# Altium project tester_board.PrjPCB (part 3 of 4)

## Sheet pulse_gen.SchDoc: Pulse Generation
size A; Engineer: A. Peck; Organization: UCLA High Energy Physics; DocumentNumber: 11; Revision: 3.0; SheetNumber: 11; SheetTotal: 15; Project: LCT Comparator Tester
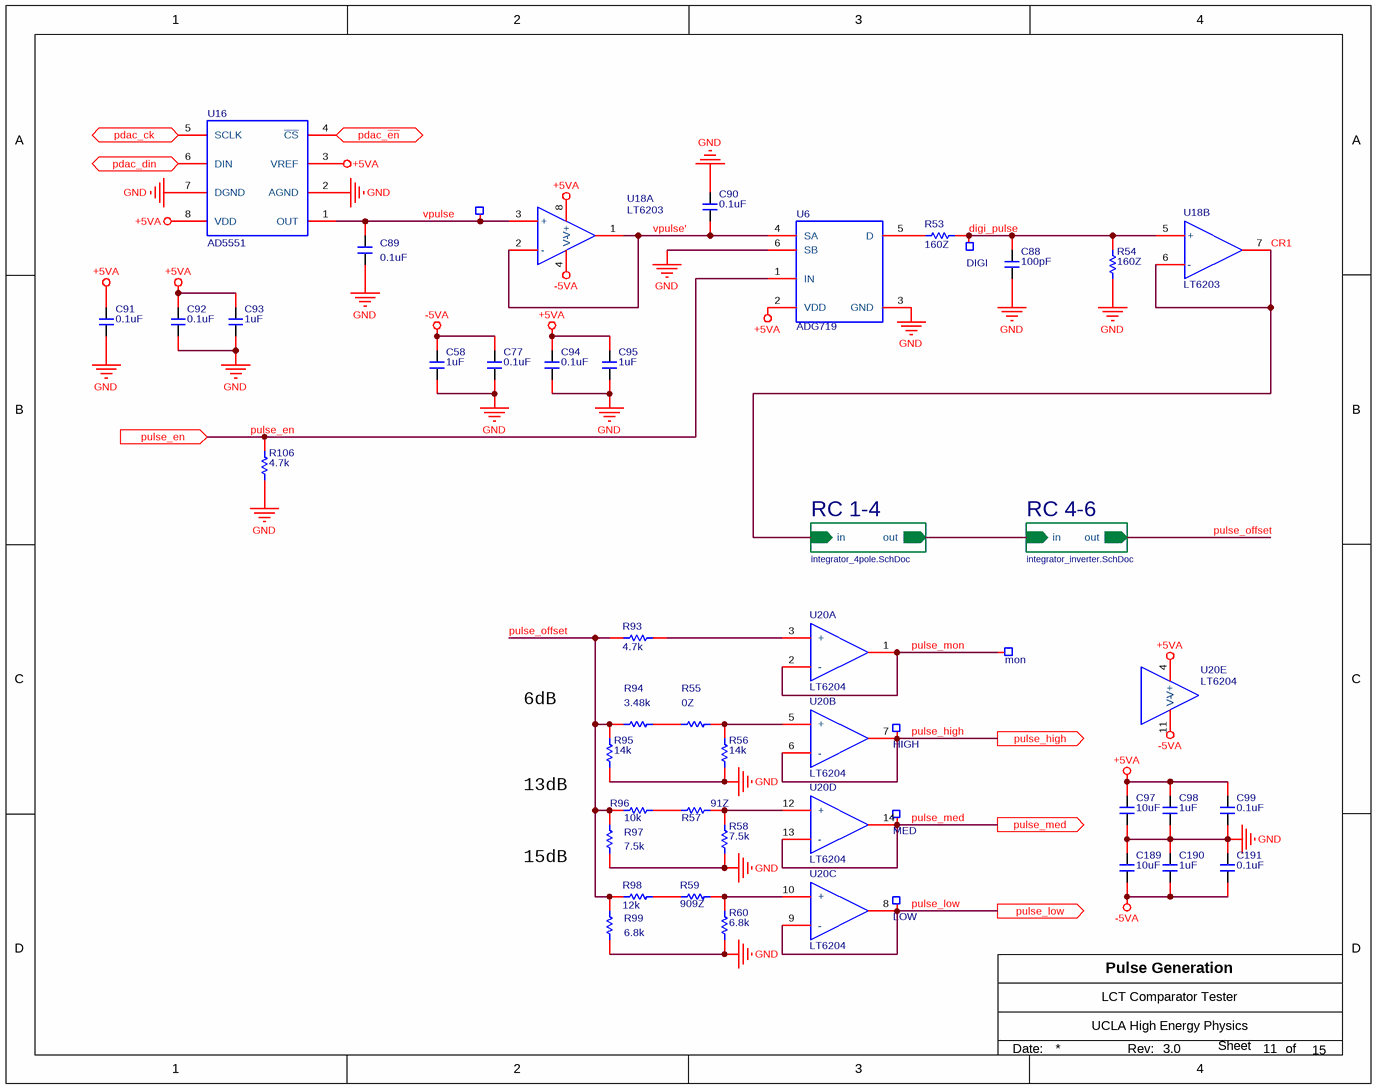
[diagram p9: pulse_gen.SchDoc]

### Parts
C58  1uF  [C0603]
C77  0.1uF  [C0603]
C88  100pF  [C0603]
C89  0.1uF  [C0603]
C90  0.1uF  [C0603]
C91  0.1uF  [C0603]
C92  0.1uF  [C0603]
C93  1uF  [C0603]
C94  0.1uF  [C0603]
C95  1uF  [C0603]
C97  10uF  [c1206]
C98  1uF  [C0603]
C99  0.1uF  [C0603]
C189  10uF  [c1206]
C190  1uF  [C0603]
C191  0.1uF  [C0603]
mon  TP_SMALL  [TP_SMALL]  (value not drawn)  (no BOM)
R53  160Z  [R0603]
R54  160Z  [R0603]
R55  0Z  [R0805]
R56  14k  [R0805]
R57  91Z  [R0805]
R58  7.5k  [R0805]
R59  909Z  [R0805]
R60  6.8k  [R0805]
R93  4.7k  [R0805]
R94  3.48k  [R0805]
R95  14k  [R0805]
R96  10k  [R0805]
R97  7.5k  [R0805]
R98  12k  [R0805]
R99  6.8k  [R0805]
R106  4.7k  [R0603]
TP27  PDAC  [TP_MICRO]  (value not drawn)  (no BOM)
TP28  DIGI  [TP_MICRO]  (no BOM)
TP29  HIGH  [TP_MICRO]  (no BOM)
TP30  MED  [TP_MICRO]  (no BOM)
TP31  LOW  [TP_MICRO]  (no BOM)
U6  ADG719  [SOT23-6]
U16  AD5551  [SOIC-8]
U18  LT6203  [SOIC-8]  (parts A,B of 2)
U20  LT6204  [SOIC-14]  (parts A,B,C,D,E of 5)

### Sub-sheets
RC 1-4 = integrator_4pole.SchDoc: out (out), in (in)
RC 4-6 = integrator_inverter.SchDoc: out (out), in (in)

### Ports
pdac_ck (in), pdac_din (in), pdac_~{en} (in), pulse_en (in), pulse_high (out), pulse_low (out), pulse_med (out)

### Nets
+5VA: C91.2 C92.2 C93.2 C94.2 C95.2 C97.1 C98.2 C99.2 U6.2(VDD) U16.3(VREF) U16.8(VDD) U18.8(V+) U20.4(V+)
-5VA: C58.2 C77.2 C189.2 C190.1 C191.1 U18.4(V-) U20.11(V-)
GND: C58.1 C77.1 C88.1 C89.1 C90.1 C91.1 C92.1 C93.1 C94.1 C95.1 C97.2 C98.1 C99.1 C189.1 C190.2 C191.2 R54.1 R56.1 R58.1 R60.1 R95.1 R97.1 R99.1 R106.1 U6.3(GND) U6.6(SB) U16.2(AGND) U16.7(DGND)
CR1: U18.6(-) U18.7(OUTB) ; sheet RC 1-4/in
digi_pulse: C88.2 R53.2 R54.2 TP28.1 U18.5(+)
p4: sheet RC 1-4/out, sheet RC 4-6/in
pdac_~{en}: U16.4(~{CS}) ; port pdac_~{en}
pulse_en: R106.2 U6.1(IN) ; port pulse_en
pulse_high: TP29.1 U20.6(-) U20.7(OUT) ; port pulse_high
pulse_low: TP31.1 U20.8(OUT) U20.9(-) ; port pulse_low
pulse_med: TP30.1 U20.13(-) U20.14(OUT) ; port pulse_med
pulse_mon: mon.1 U20.1(OUT) U20.2(-)
pulse_offset: R93.1 R94.1 R95.2 R96.1 R97.2 R98.1 R99.2 ; sheet RC 4-6/out
spi0_mosi: U16.6(DIN) ; port pdac_din
spi0_sclk: U16.5(SCLK) ; port pdac_ck
vpulse: C89.2 TP27.1 U16.1(OUT) U18.3(+)
vpulse': C90.2 U6.4(SA) U18.1(OUTA) U18.2(-)
NetR53_1: R53.1 U6.5(NC)
NetR55_1: R55.1 R94.2
NetR55_2: R55.2 R56.2 U20.5(+)
NetR57_1: R57.1 R96.2
NetR57_2: R57.2 R58.2 U20.12(+)
NetR59_1: R59.1 R60.2 U20.10(+)
NetR59_2: R59.2 R98.2
NetR93_2: R93.2 U20.3(+)

### Notes on the sheet
- 6dB
- 13dB
- 15dB
- Date:
- Rev:
- of
- Sheet

### Library data of the parts
C58 C93 C95 C98 C190 = Murata/GRM188R61E105KA12D: as C2 on sheet lct_comp; Supplier 1: Digi-Key; Supplier Part Number 1: 490-3897-1-ND; Manufacturer Part Number: GRM188R61E105KA12D; RoHS: RoHS Compliant; Category: Capacitors; Stock 1: 1899119; Pricing 1: 1=0.1, 10=0.036, 50=0.0196, 100=0.0165, 250=0.01352, 500=0.01156, 1000=0.009 (USD); Packaging: Cut Tape (CT); Tolerance: ±10%; Voltage - Rated: 25V; Mounting Type: Surface Mount, MLCC; Operating Temperature: -55°C ~ 85°C; Applications: General Purpose; Ratings: -; Package / Case: 0603 (1608 Metric); Size / Dimension: 0.063" L x 0.031" W (1.60mm x 0.80mm); Height - Seated (Max): -; Thickness (Max): 0.035" (0.90mm); Lead Spacing: -; Features: -; Lead Style: -; ComponentLink1URL: http://www.murata.com/~/media/webrenewal/support/library/catalog/products/capacitor/mlcc/c02e.pdf; ComponentLink1Description: http://www.murata.com/~/media/webrenewal/support/library/catalog/products/capacitor/mlcc/c02e.pdf
C77 C89-C92 C94 C99 C191 = CAP/06035C104KAT2A: as C3 on sheet lct_comp; Supplier 1: Digi-Key; Manufacturer Part Number: 06035C104KAT2A; RoHS: RoHS Compliant; Category: Capacitors; Stock 1: 4412408; Pricing 1: 1=0.1, 10=0.036, 25=0.0264, 50=0.0198, 100=0.0162, 250=0.01352, 500=0.01156, 1000=0.00908 (USD); Packaging: Cut Tape (CT); Tolerance: ±10%; Voltage - Rated: 50V; Temperature Coefficient: X7R; Mounting Type: Surface Mount, MLCC; Operating Temperature: -55°C ~ 125°C; Applications: General Purpose; Ratings: -; Package / Case: 0603 (1608 Metric); Size / Dimension: 0.063" L x 0.032" W (1.60mm x 0.81mm); Height - Seated (Max): -; Thickness (Max): 0.035" (0.90mm); Lead Spacing: -; Features: -; Lead Style: -; ComponentLink1URL: http://datasheets.avx.com/X7RDielectric.pdf; ComponentLink1Description: http://datasheets.avx.com/X7RDielectric.pdf; Supplier Part Number 1: 478-5052-1-ND; Supplier 2: Newark; Supplier Part Number 2: 54K2412
C88 = AVX/06035A101KAT2A: as C200 on sheet charge_pump; Supplier 1: Digi-Key; Supplier Part Number 1: 478-3717-1-ND; Manufacturer Part Number: 06035A101KAT2A; RoHS: RoHS Compliant; Category: Capacitors; Stock 1: 55355; Pricing 1: 1=0.16, 10=0.117, 25=0.0856, 50=0.0664, 100=0.0551, 250=0.04556, 500=0.03862, 1000=0.03197 (USD); Packaging: Cut Tape (CT); Part Status: Active; Capacitance: 100pF; Tolerance: ±10%; Voltage - Rated: 50V; Operating Temperature: -55°C ~ 125°C; Features: -; Ratings: -; Applications: General Purpose; Failure Rate: *; Mounting Type: Surface Mount, MLCC; Package / Case: 0603 (1608 Metric); Size / Dimension: 0.063" L x 0.032" W (1.60mm x 0.81mm); Height - Seated (Max): -; Thickness (Max): 0.035" (0.90mm); Lead Spacing: -; Lead Style: -; ComponentLink1URL: http://catalogs.avx.com/SurfaceMount.pdf; ComponentLink1Description: http://catalogs.avx.com/SurfaceMount.pdf
C97 C189 = CAP/GMK316F106ZL-T: as C39 on sheet lct_comp; Supplier 1: Digi-Key; Manufacturer Part Number: GMK316F106ZL-T; RoHS: RoHS Compliant; Category: Capacitors; Packaging: Cut Tape (CT); Voltage - Rated: 35V; Mounting Type: Surface Mount, MLCC; Operating Temperature: -30°C ~ 85°C; Package / Case: 1206 (3216 Metric); Size / Dimension: 0.126" L x 0.063" W (3.20mm x 1.60mm); Height - Seated (Max): -; Lead Spacing: -; Features: -; ComponentLink1URL: http://ds.yuden.co.jp/TYCOMPAS/ut/detail.do?productNo=GMK316F106ZL-T&fileName=GMK316F106ZL-T_SS&mode=specSheetDownload; ComponentLink1Description: http://ds.yuden.co.jp/TYCOMPAS/ut/detail.do?productNo=GMK316F106ZL-T&fileName=GMK316F106ZL-T_SS&mode=specSheetDownload; Supplier Part Number 1: 587-1352-1-ND; Stock 1: 249989; Pricing 1: 1=0.46, 10=0.345, 50=0.2012, 100=0.161, 250=0.115, 500=0.0782, 1000=0.06325 (USD); Applications: General Purpose; Ratings: -; Thickness (Max): 0.071" (1.80mm); Lead Style: -
mon = TP_SMALL: Test Point, Generic, 50MIL
R53 R54 = CRCW0603160RFKEA: as R39 on sheet spartan6; Supplier 1: Digi-Key; Manufacturer Part Number: CRCW0603160RFKEA; RoHS: RoHS Compliant; Category: Resistors; Stock 1: 48671; Pricing 1: 1=0.1, 10=0.03, 25=0.022, 50=0.0168, 100=0.0123, 250=0.0094, 500=0.00752, 1000=0.00554, 2500=0.00481 (USD); Packaging: Cut Tape (CT); Part Status: Active; Composition: Thick Film; Features: Automotive AEC-Q200; Operating Temperature: -55°C ~ 155°C; Package / Case: 0603 (1608 Metric); Supplier Device Package: 0603; Size / Dimension: 0.063" L x 0.033" W (1.60mm x 0.85mm); Height - Seated (Max): 0.020" (0.50mm); Number of Terminations: 2; Failure Rate: -; ComponentLink1URL: http://www.vishay.com/docs/20035/dcrcwe3.pdf; ComponentLink1Description: http://www.vishay.com/docs/20035/dcrcwe3.pdf; Supplier Part Number 1: 541-160HCT-ND
R55 = CRCW08050000Z0EA: RES0, SMD, 0.00Z, 0805; Manufacturer: Vishay Dale; Resistance (Ohms): 0.0; Tolerance: Jumper; Power (Watts): 0.125W, 1/8W; Supplier 1: Digi-Key; Manufacturer Part Number: CRCW08050000Z0EA; RoHS: RoHS Compliant; Category: Resistors; Stock 1: 1159983; Pricing 1: 1=0.1, 10=0.026, 25=0.0184, 50=0.014, 100=0.0104, 250=0.00792, 500=0.00634, 1000=0.00466, 2500=0.00405 (USD); Packaging: Cut Tape (CT); Part Status: Active; Composition: Thick Film; Features: Automotive AEC-Q200; Temperature Coefficient: -; Operating Temperature: -55°C ~ 155°C; Package / Case: 0805 (2012 Metric); Supplier Device Package: 0805; Size / Dimension: 0.079" L x 0.049" W (2.00mm x 1.25mm); Height - Seated (Max): 0.020" (0.50mm); Number of Terminations: 2; Failure Rate: -; ComponentLink1URL: http://www.vishay.com/docs/20035/dcrcwe3.pdf; ComponentLink1Description: http://www.vishay.com/docs/20035/dcrcwe3.pdf; Supplier Part Number 1: 541-0.0ACT-ND
R56 R95 = RC0805FR-0714KL: RES1, SMD, 14.0k, 1.0%, 1/8W, 0805; Manufacturer: Yageo; Tolerance: ±1%; Power (Watts): 0.125W, 1/8W; Temperature Coefficient: ±100ppm/°C; Supplier 1: Digi-Key; Manufacturer Part Number: RC0805FR-0714KL; RoHS: RoHS Compliant; Category: Resistors; Stock 1: 169694; Pricing 1: 1=0.1, 10=0.021, 25=0.0152, 100=0.0084, 250=0.00644, 500=0.00514, 1000=0.00379, 2500=0.00329 (USD); Packaging: Cut Tape (CT); Part Status: Active; Resistance (Ohms): 14k; Composition: Thick Film; Features: Moisture Resistant; Operating Temperature: -55°C ~ 155°C; Package / Case: 0805 (2012 Metric); Supplier Device Package: 0805; Size / Dimension: 0.079" L x 0.049" W (2.00mm x 1.25mm); Height - Seated (Max): 0.024" (0.60mm); Number of Terminations: 2; Failure Rate: -; ComponentLink1URL: http://www.yageo.com/NewPortal/yageodocoutput?fileName=/pdf/R-Chip/PYu-RC_Group_51_RoHS_L_4.pdf; ComponentLink1Description: http://www.yageo.com/NewPortal/yageodocoutput?fileName=/pdf/R-Chip/PYu-RC_Group_51_RoHS_L_4.pdf; Supplier Part Number 1: 311-14.0KCRCT-ND
R57 = ERJ-6ENF91R0V: RES0, SMD, 91Z, 1.0%, 1/8W, 0805; Manufacturer: Panasonic Electronic Components; Resistance (Ohms): 91; Tolerance: ±1%; Power (Watts): 0.125W, 1/8W; Temperature Coefficient: ±100ppm/°C; Supplier 1: Digi-Key; Manufacturer Part Number: ERJ-6ENF91R0V; RoHS: RoHS Compliant; Category: Resistors; Stock 1: 64099; Pricing 1: 1=0.1, 50=0.022, 100=0.0162, 250=0.01236, 500=0.0099, 1000=0.00729 (USD); Packaging: Cut Tape (CT); Part Status: Active; Composition: Thick Film; Features: Automotive AEC-Q200; Operating Temperature: -55°C ~ 155°C; Package / Case: 0805 (2012 Metric); Supplier Device Package: 0805; Size / Dimension: 0.079" L x 0.049" W (2.00mm x 1.25mm); Height - Seated (Max): 0.028" (0.70mm); Number of Terminations: 2; Failure Rate: -; ComponentLink1URL: http://industrial.panasonic.com/www-cgi/jvcr13pz.cgi?E+PZ+3+AOA0002+ERJ6ENF91R0V+7+WW; ComponentLink1Description: http://industrial.panasonic.com/www-cgi/jvcr13pz.cgi?E+PZ+3+AOA0002+ERJ6ENF91R0V+7+WW; Supplier Part Number 1: P91.0CCT-ND
R58 R97 = RC0805FR-077K5L: RES1, SMD, 7.5k, 1.0%, 1/8W, 0805; Manufacturer: Yageo; Tolerance: ±1%; Power (Watts): 0.125W, 1/8W; Temperature Coefficient: ±100ppm/°C; Supplier 1: Digi-Key; Manufacturer Part Number: RC0805FR-077K5L; RoHS: RoHS Compliant; Category: Resistors; Stock 1: 186916; Pricing 1: 1=0.1, 10=0.021, 25=0.0152, 100=0.0084, 250=0.00644, 500=0.00514, 1000=0.00379, 2500=0.00329 (USD); Packaging: Cut Tape (CT); Part Status: Active; Resistance (Ohms): 7.5k; Composition: Thick Film; Features: Moisture Resistant; Operating Temperature: -55°C ~ 155°C; Package / Case: 0805 (2012 Metric); Supplier Device Package: 0805; Size / Dimension: 0.079" L x 0.049" W (2.00mm x 1.25mm); Height - Seated (Max): 0.024" (0.60mm); Number of Terminations: 2; Failure Rate: -; ComponentLink1URL: http://www.yageo.com/NewPortal/yageodocoutput?fileName=/pdf/R-Chip/PYu-RC_Group_51_RoHS_L_4.pdf; ComponentLink1Description: http://www.yageo.com/NewPortal/yageodocoutput?fileName=/pdf/R-Chip/PYu-RC_Group_51_RoHS_L_4.pdf; Supplier Part Number 1: 311-7.50KCRCT-ND
R59 = RC0805FR-07909RL: RES0, SMD, 6.8k, 1.0%, 1/8W, 0805; Manufacturer: Yageo; Resistance (Ohms): 909; Tolerance: ±1%; Power (Watts): 0.125W, 1/8W; Temperature Coefficient: ±100ppm/°C; Supplier 1: Digi-Key; Manufacturer Part Number: RC0805FR-07909RL; RoHS: RoHS Compliant; Category: Resistors; Stock 1: 53236; Pricing 1: 1=0.1, 10=0.021, 25=0.0152, 100=0.0084, 250=0.00644, 500=0.00514, 1000=0.00379, 2500=0.00329 (USD); Packaging: Cut Tape (CT); Part Status: Active; Composition: Thick Film; Features: Moisture Resistant; Operating Temperature: -55°C ~ 155°C; Package / Case: 0805 (2012 Metric); Supplier Device Package: 0805; Size / Dimension: 0.079" L x 0.049" W (2.00mm x 1.25mm); Height - Seated (Max): 0.024" (0.60mm); Number of Terminations: 2; Failure Rate: -; ComponentLink1URL: http://www.yageo.com/NewPortal/yageodocoutput?fileName=/pdf/R-Chip/PYu-RC_Group_51_RoHS_L_4.pdf; ComponentLink1Description: http://www.yageo.com/NewPortal/yageodocoutput?fileName=/pdf/R-Chip/PYu-RC_Group_51_RoHS_L_4.pdf; Supplier Part Number 1: 311-909CRCT-ND
R60 R99 = RC0805FR-076K8L: RES1, SMD, 6.8k, 1.0%, 1/8W, 0805; Manufacturer: Yageo; Tolerance: ±1%; Power (Watts): 0.125W, 1/8W; Temperature Coefficient: ±100ppm/°C; Supplier 1: Digi-Key; Manufacturer Part Number: RC0805FR-076K8L; RoHS: RoHS Compliant; Category: Resistors; Stock 1: 249753; Pricing 1: 1=0.1, 10=0.021, 25=0.0152, 100=0.0084, 250=0.00644, 500=0.00514, 1000=0.00379, 2500=0.00329 (USD); Packaging: Cut Tape (CT); Part Status: Active; Resistance (Ohms): 6.8k; Composition: Thick Film; Features: Moisture Resistant; Operating Temperature: -55°C ~ 155°C; Package / Case: 0805 (2012 Metric); Supplier Device Package: 0805; Size / Dimension: 0.079" L x 0.049" W (2.00mm x 1.25mm); Height - Seated (Max): 0.024" (0.60mm); Number of Terminations: 2; Failure Rate: -; ComponentLink1URL: http://www.yageo.com/NewPortal/yageodocoutput?fileName=/pdf/R-Chip/PYu-RC_Group_51_RoHS_L_4.pdf; ComponentLink1Description: http://www.yageo.com/NewPortal/yageodocoutput?fileName=/pdf/R-Chip/PYu-RC_Group_51_RoHS_L_4.pdf; Supplier Part Number 1: 311-6.80KCRCT-ND
R93 = CRCW08054K70FKEA: RES1, SMD, 4.70k, 1.0%, 1/10W, 0805; Manufacturer: Vishay Dale; Tolerance: ±1%; Power (Watts): 0.125W, 1/8W; Temperature Coefficient: ±100ppm/°C; Supplier 1: Digi-Key; Manufacturer Part Number: CRCW08054K70FKEA; RoHS: RoHS Compliant; Category: Resistors; Stock 1: 53264; Pricing 1: 1=0.1, 10=0.04, 25=0.0288, 50=0.022, 100=0.0162, 250=0.01236, 500=0.0099, 1000=0.00729, 2500=0.00632 (USD); Packaging: Cut Tape (CT); Part Status: Active; Resistance (Ohms): 4.7k; Composition: Thick Film; Features: Automotive AEC-Q200; Operating Temperature: -55°C ~ 155°C; Package / Case: 0805 (2012 Metric); Supplier Device Package: 0805; Size / Dimension: 0.079" L x 0.049" W (2.00mm x 1.25mm); Height - Seated (Max): 0.020" (0.50mm); Number of Terminations: 2; Failure Rate: -; ComponentLink1URL: http://www.vishay.com/docs/20035/dcrcwe3.pdf; ComponentLink1Description: http://www.vishay.com/docs/20035/dcrcwe3.pdf; Supplier Part Number 1: 541-4.70KCCT-ND
R94 = RC0805FR-073K48L: RES1, SMD, 3.48k, 1.0%, 1/10W, 0805; Manufacturer: Yageo; Tolerance: ±1%; Power (Watts): 0.125W, 1/8W; Temperature Coefficient: ±100ppm/°C; Supplier 1: Digi-Key; Manufacturer Part Number: RC0805FR-073K48L; RoHS: RoHS Compliant; Category: Resistors; Stock 1: 122027; Pricing 1: 1=0.1, 10=0.021, 25=0.0152, 100=0.0084, 250=0.00644, 500=0.00514, 1000=0.00379, 2500=0.00329 (USD); Packaging: Cut Tape (CT); Part Status: Active; Resistance (Ohms): 3.48k; Composition: Thick Film; Features: Moisture Resistant; Operating Temperature: -55°C ~ 155°C; Package / Case: 0805 (2012 Metric); Supplier Device Package: 0805; Size / Dimension: 0.079" L x 0.049" W (2.00mm x 1.25mm); Height - Seated (Max): 0.024" (0.60mm); Number of Terminations: 2; Failure Rate: -; ComponentLink1URL: http://www.yageo.com/NewPortal/yageodocoutput?fileName=/pdf/R-Chip/PYu-RC_Group_51_RoHS_L_4.pdf; ComponentLink1Description: http://www.yageo.com/NewPortal/yageodocoutput?fileName=/pdf/R-Chip/PYu-RC_Group_51_RoHS_L_4.pdf; Supplier Part Number 1: 311-3.48KCRCT-ND
R96 = RC0805FR-0710KL: RES1, SMD, 10.0k, 1.0%, 1/8W, 0805; Manufacturer: Yageo; Tolerance: ±1%; Power (Watts): 0.125W, 1/8W; Temperature Coefficient: ±100ppm/°C; Supplier 1: Digi-Key; Manufacturer Part Number: RC0805FR-0710KL; RoHS: RoHS Compliant; Category: Resistors; Stock 1: 9171495; Pricing 1: 1=0.1, 10=0.021, 25=0.0152, 100=0.0084, 250=0.00644, 500=0.00514, 1000=0.00379, 2500=0.00329 (USD); Packaging: Cut Tape (CT); Part Status: Active; Resistance (Ohms): 10k; Composition: Thick Film; Features: Moisture Resistant; Operating Temperature: -55°C ~ 155°C; Package / Case: 0805 (2012 Metric); Supplier Device Package: 0805; Size / Dimension: 0.079" L x 0.049" W (2.00mm x 1.25mm); Height - Seated (Max): 0.024" (0.60mm); Number of Terminations: 2; Failure Rate: -; ComponentLink1URL: http://www.yageo.com/NewPortal/yageodocoutput?fileName=/pdf/R-Chip/PYu-RC_Group_51_RoHS_L_4.pdf; ComponentLink1Description: http://www.yageo.com/NewPortal/yageodocoutput?fileName=/pdf/R-Chip/PYu-RC_Group_51_RoHS_L_4.pdf; Supplier Part Number 1: 311-10.0KCRCT-ND
R98 = RC0805FR-0712KL: RES1, SMD, 12.0k, 1.0%, 1/8W, 0805; Manufacturer: Yageo; Tolerance: ±1%; Power (Watts): 0.125W, 1/8W; Temperature Coefficient: ±100ppm/°C; Supplier 1: Digi-Key; Manufacturer Part Number: RC0805FR-0712KL; RoHS: RoHS Compliant; Category: Resistors; Stock 1: 293503; Pricing 1: 1=0.1, 10=0.021, 25=0.0152, 100=0.0084, 250=0.00644, 500=0.00514, 1000=0.00379, 2500=0.00329 (USD); Packaging: Cut Tape (CT); Part Status: Active; Resistance (Ohms): 12k; Composition: Thick Film; Features: Moisture Resistant; Operating Temperature: -55°C ~ 155°C; Package / Case: 0805 (2012 Metric); Supplier Device Package: 0805; Size / Dimension: 0.079" L x 0.049" W (2.00mm x 1.25mm); Height - Seated (Max): 0.024" (0.60mm); Number of Terminations: 2; Failure Rate: -; ComponentLink1URL: http://www.yageo.com/NewPortal/yageodocoutput?fileName=/pdf/R-Chip/PYu-RC_Group_51_RoHS_L_4.pdf; ComponentLink1Description: http://www.yageo.com/NewPortal/yageodocoutput?fileName=/pdf/R-Chip/PYu-RC_Group_51_RoHS_L_4.pdf; Supplier Part Number 1: 311-12.0KCRCT-ND
R106 = CRCW06034K70FKEA: as R65 on sheet charge_pump; Supplier 1: Digi-Key; Manufacturer Part Number: CRCW06034K70FKEA; RoHS: RoHS Compliant; Category: Resistors; Stock 1: 413202; Pricing 1: 1=0.1, 10=0.03, 25=0.022, 50=0.0168, 100=0.0123, 250=0.0094, 500=0.00752, 1000=0.00554, 2500=0.00481 (USD); Packaging: Cut Tape (CT); Part Status: Active; Resistance (Ohms): 4.7k; Composition: Thick Film; Features: Automotive AEC-Q200; Operating Temperature: -55°C ~ 155°C; Package / Case: 0603 (1608 Metric); Supplier Device Package: 0603; Size / Dimension: 0.063" L x 0.033" W (1.60mm x 0.85mm); Height - Seated (Max): 0.020" (0.50mm); Number of Terminations: 2; Failure Rate: -; ComponentLink1URL: http://www.vishay.com/docs/20035/dcrcwe3.pdf; ComponentLink1Description: http://www.vishay.com/docs/20035/dcrcwe3.pdf; Supplier Part Number 1: 541-4.70KHCT-ND
TP27-TP31 = TP_MICRO: Test Point, Round, Small
U6 = ADG719 SOT23-6: SWITCH, SPDT, 2:1, 4 Ohm; Manufacturer: Analog Devices Inc.; Manufacturer Part Number: ADG719BRTZ-500RL7; Number of Circuits: 1; On-State Resistance (Max): 4 Ohm; Voltage - Supply, Single (V+): 1.8 V ~ 5.5 V; Switch Time (Ton, Toff) (Max): 7ns, 3ns (Typ); -3db Bandwidth: 200MHz; Channel Capacitance (CS(off), CD(off)): 7pF; Current - Leakage (IS(off)) (Max): 250pA; Crosstalk: -82dB @ 1MHz; Supplier 1: Digi-Key; RoHS: RoHS Compliant; Category: Integrated Circuits (ICs); Stock 1: 984; Pricing 1: 1=2.95, 10=2.648, 100=2.1281 (USD); Packaging: Cut Tape (CT); Part Status: Active; Switch Circuit: SPDT; Multiplexer/Demultiplexer Circuit: 2:1; Channel-to-Channel Matching (&Delta;Ron): -; Voltage - Supply, Dual (V±): -; Charge Injection: -; Operating Temperature: -40°C ~ 125°C (TA); Package / Case: SOT-23-6; Supplier Device Package: SOT-23-6; ComponentLink1URL: http://www.analog.com/media/en/technical-documentation/data-sheets/ADG719.pdf; ComponentLink1Description: http://www.analog.com/media/en/technical-documentation/data-sheets/ADG719.pdf; Supplier Part Number 1: ADG719BRTZ-500RL7CT-ND
U16 = AD/AD5551 SOIC-8: DAC, 14-BIT, 1MSPS; Manufacturer: Analog Devices Inc.; Manufacturer Part Number: AD5551BRZ; Number of Bits: 14; Number of D/A Converters: 1; Settling Time: 1µs (Typ); Output Type: Voltage - Unbuffered; Differential Output: No; Data Interface: SPI; Reference Type: External; Voltage - Supply, Analog: 2.7 V ~ 5.5 V; INL/DNL (LSB): ±0.15, ±0.15; Architecture: R-2R; Supplier 1: Digi-Key; RoHS: RoHS Compliant; Category: Integrated Circuits (ICs); Packaging: Tube; Part Status: Active; Voltage - Supply, Digital: 2.7 V ~ 5.5 V; Operating Temperature: -40°C ~ 85°C; Package / Case: 8-SOIC (0.154", 3.90mm Width); Supplier Device Package: 8-SOIC; ComponentLink1URL: http://www.analog.com/media/en/technical-documentation/data-sheets/AD5551_5552.pdf; ComponentLink1Description: http://www.analog.com/media/en/technical-documentation/data-sheets/AD5551_5552.pdf; Stock 1: 625; Pricing 1: 1=16.85, 10=15.487, 100=13.0795, 500=11.63516, 1000=10.67225, 2500=10.27104, 5000=9.95007 (USD); Supplier Part Number 1: AD5551BRZ-ND
U18 = LT6203 SOIC-8: OPA, 100MHz, Dual, RRIO, Single-supply, Unity Stable; Supplier 1: Digi-Key; Supplier Part Number 1: LT6203CS8#PBF-ND
U20 = LT6204 SOIC-14: OPA, 100MHz, Quad, RRIO, Unity Stable; Supplier 1: Digi-Key; Supplier Part Number 1: LT6204CS#PBF-ND

## Sheet integrator_4pole.SchDoc: Active Integrator
size A; Engineer: A. Peck; Organization: UCLA High Energy Physics; DocumentNumber: 12; Revision: 3.0; SheetNumber: 12; SheetTotal: 15; Project: LCT Comparator Tester
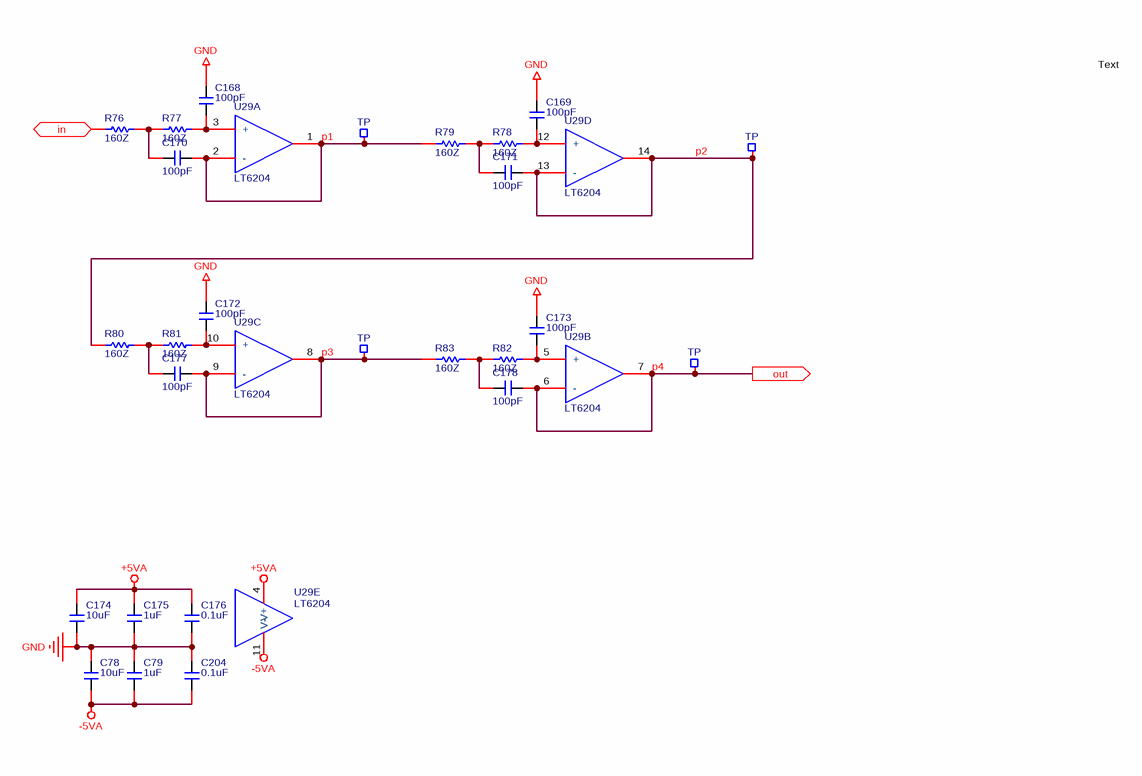
[diagram p10: integrator_4pole.SchDoc]

### Parts
C78  10uF  [c1206]
C79  1uF  [C0603]
C168  100pF  [C0603]
C169  100pF  [C0603]
C170  100pF  [C0603]
C171  100pF  [C0603]
C172  100pF  [C0603]
C173  100pF  [C0603]
C174  10uF  [c1206]
C175  1uF  [C0603]
C176  0.1uF  [C0603]
C177  100pF  [C0603]
C178  100pF  [C0603]
C204  0.1uF  [C0603]
R76  160Z  [R0603]
R77  160Z  [R0603]
R78  160Z  [R0603]
R79  160Z  [R0603]
R80  160Z  [R0603]
R81  160Z  [R0603]
R82  160Z  [R0603]
R83  160Z  [R0603]
TP8  TP  [TP_MICRO]  (no BOM)
TP33  TP  [TP_MICRO]  (no BOM)
TP34  TP  [TP_MICRO]  (no BOM)
TP35  TP  [TP_MICRO]  (no BOM)
U29  LT6204  [SOIC-14]  (parts A,B,C,D,E of 5)

### Ports
in (in), out (out)

### Nets
+5VA: C174.1 C175.2 C176.2 U29.4(V+)
-5VA: C78.2 C79.1 C204.1 U29.11(V-)
GND: C78.1 C79.2 C168.2 C169.2 C172.2 C173.2 C174.2 C175.1 C176.1 C204.2
CR1: R76.1 ; port in
p1: C170.2 R79.1 TP8.1 U29.1(OUT) U29.2(-)
p2: C171.2 R80.1 TP33.1 U29.13(-) U29.14(OUT)
p3: C177.2 R83.1 TP34.1 U29.8(OUT) U29.9(-)
p4: C178.2 TP35.1 U29.6(-) U29.7(OUT) ; port out
NetC168_1: C168.1 R77.2 U29.3(+)
NetC169_1: C169.1 R78.2 U29.12(+)
NetC170_1: C170.1 R76.2 R77.1
NetC171_1: C171.1 R78.1 R79.2
NetC172_1: C172.1 R81.2 U29.10(+)
NetC173_1: C173.1 R82.2 U29.5(+)
NetC177_1: C177.1 R80.2 R81.1
NetC178_1: C178.1 R82.1 R83.2

### Notes on the sheet
- Text
- Date:
- Rev:
- of
- Sheet

### Library data of the parts
C78 C174 = CAP/GMK316F106ZL-T: CAP-CER, 2, 10uF, 10%, 35V, 1206; Manufacturer: Taiyo Yuden; Capacitance: 10µF; Tolerance: -20%, +80%; Temperature Coefficient: Y5V (F); Supplier 1: Digi-Key; Manufacturer Part Number: GMK316F106ZL-T; RoHS: RoHS Compliant; Category: Capacitors; Packaging: Cut Tape (CT); Voltage - Rated: 35V; Mounting Type: Surface Mount, MLCC; Operating Temperature: -30°C ~ 85°C; Package / Case: 1206 (3216 Metric); Size / Dimension: 0.126" L x 0.063" W (3.20mm x 1.60mm); Height - Seated (Max): -; Lead Spacing: -; Features: -; ComponentLink1URL: http://ds.yuden.co.jp/TYCOMPAS/ut/detail.do?productNo=GMK316F106ZL-T&fileName=GMK316F106ZL-T_SS&mode=specSheetDownload; ComponentLink1Description: http://ds.yuden.co.jp/TYCOMPAS/ut/detail.do?productNo=GMK316F106ZL-T&fileName=GMK316F106ZL-T_SS&mode=specSheetDownload; Supplier Part Number 1: 587-1352-1-ND; Stock 1: 249989; Pricing 1: 1=0.46, 10=0.345, 50=0.2012, 100=0.161, 250=0.115, 500=0.0782, 1000=0.06325 (USD); Applications: General Purpose; Ratings: -; Thickness (Max): 0.071" (1.80mm); Lead Style: -
C79 C175 = Murata/GRM188R61E105KA12D: CAP-CER, 2, 1.0uF, 10%, 25V, 0603; Manufacturer: Murata Electronics North America; Capacitance: 1µF; Temperature Coefficient: X5R; Supplier 1: Digi-Key; Supplier Part Number 1: 490-3897-1-ND; Manufacturer Part Number: GRM188R61E105KA12D; RoHS: RoHS Compliant; Category: Capacitors; Stock 1: 1899119; Pricing 1: 1=0.1, 10=0.036, 50=0.0196, 100=0.0165, 250=0.01352, 500=0.01156, 1000=0.009 (USD); Packaging: Cut Tape (CT); Tolerance: ±10%; Voltage - Rated: 25V; Mounting Type: Surface Mount, MLCC; Operating Temperature: -55°C ~ 85°C; Applications: General Purpose; Ratings: -; Package / Case: 0603 (1608 Metric); Size / Dimension: 0.063" L x 0.031" W (1.60mm x 0.80mm); Height - Seated (Max): -; Thickness (Max): 0.035" (0.90mm); Lead Spacing: -; Features: -; Lead Style: -; ComponentLink1URL: http://www.murata.com/~/media/webrenewal/support/library/catalog/products/capacitor/mlcc/c02e.pdf; ComponentLink1Description: http://www.murata.com/~/media/webrenewal/support/library/catalog/products/capacitor/mlcc/c02e.pdf
C168-C173 C177 C178 = AVX/06035A101KAT2A: CAP-CER, 0, 100pF, 10%, 50V, 0603; Manufacturer: AVX Corporation; Temperature Coefficient: C0G, NP0; Supplier 1: Digi-Key; Supplier Part Number 1: 478-3717-1-ND; Manufacturer Part Number: 06035A101KAT2A; RoHS: RoHS Compliant; Category: Capacitors; Stock 1: 55355; Pricing 1: 1=0.16, 10=0.117, 25=0.0856, 50=0.0664, 100=0.0551, 250=0.04556, 500=0.03862, 1000=0.03197 (USD); Packaging: Cut Tape (CT); Part Status: Active; Capacitance: 100pF; Tolerance: ±10%; Voltage - Rated: 50V; Operating Temperature: -55°C ~ 125°C; Features: -; Ratings: -; Applications: General Purpose; Failure Rate: *; Mounting Type: Surface Mount, MLCC; Package / Case: 0603 (1608 Metric); Size / Dimension: 0.063" L x 0.032" W (1.60mm x 0.81mm); Height - Seated (Max): -; Thickness (Max): 0.035" (0.90mm); Lead Spacing: -; Lead Style: -; ComponentLink1URL: http://catalogs.avx.com/SurfaceMount.pdf; ComponentLink1Description: http://catalogs.avx.com/SurfaceMount.pdf
C176 C204 = CAP/06035C104KAT2A: CAP-CER, 2, 0.1uF, 10%, 50V, 0603, X7R; Manufacturer: AVX Corporation; Capacitance: 0.10µF; Supplier 1: Digi-Key; Manufacturer Part Number: 06035C104KAT2A; RoHS: RoHS Compliant; Category: Capacitors; Stock 1: 4412408; Pricing 1: 1=0.1, 10=0.036, 25=0.0264, 50=0.0198, 100=0.0162, 250=0.01352, 500=0.01156, 1000=0.00908 (USD); Packaging: Cut Tape (CT); Tolerance: ±10%; Voltage - Rated: 50V; Temperature Coefficient: X7R; Mounting Type: Surface Mount, MLCC; Operating Temperature: -55°C ~ 125°C; Applications: General Purpose; Ratings: -; Package / Case: 0603 (1608 Metric); Size / Dimension: 0.063" L x 0.032" W (1.60mm x 0.81mm); Height - Seated (Max): -; Thickness (Max): 0.035" (0.90mm); Lead Spacing: -; Features: -; Lead Style: -; ComponentLink1URL: http://datasheets.avx.com/X7RDielectric.pdf; ComponentLink1Description: http://datasheets.avx.com/X7RDielectric.pdf; Supplier Part Number 1: 478-5052-1-ND; Supplier 2: Newark; Supplier Part Number 2: 54K2412
R76-R83 = CRCW0603160RFKEA: RES0, SMD,  160Z, 1.0%, 1/10W, 0603; Manufacturer: Vishay Dale; Resistance (Ohms): 160; Tolerance: ±1%; Power (Watts): 0.1W, 1/10W; Temperature Coefficient: ±100ppm/°C; Supplier 1: Digi-Key; Manufacturer Part Number: CRCW0603160RFKEA; RoHS: RoHS Compliant; Category: Resistors; Stock 1: 48671; Pricing 1: 1=0.1, 10=0.03, 25=0.022, 50=0.0168, 100=0.0123, 250=0.0094, 500=0.00752, 1000=0.00554, 2500=0.00481 (USD); Packaging: Cut Tape (CT); Part Status: Active; Composition: Thick Film; Features: Automotive AEC-Q200; Operating Temperature: -55°C ~ 155°C; Package / Case: 0603 (1608 Metric); Supplier Device Package: 0603; Size / Dimension: 0.063" L x 0.033" W (1.60mm x 0.85mm); Height - Seated (Max): 0.020" (0.50mm); Number of Terminations: 2; Failure Rate: -; ComponentLink1URL: http://www.vishay.com/docs/20035/dcrcwe3.pdf; ComponentLink1Description: http://www.vishay.com/docs/20035/dcrcwe3.pdf; Supplier Part Number 1: 541-160HCT-ND
TP8 TP33-TP35 = TP_MICRO: Test Point, Round, Small
U29 = LT6204 SOIC-14: OPA, 100MHz, Quad, RRIO, Unity Stable; Supplier 1: Digi-Key; Supplier Part Number 1: LT6204CS#PBF-ND

## Sheet integrator_inverter.SchDoc: Active Integrator
size A; Engineer: A. Peck; Organization: UCLA High Energy Physics; DocumentNumber: 13; Revision: 3.0; SheetNumber: 13; SheetTotal: 15; Project: LCT Comparator Tester
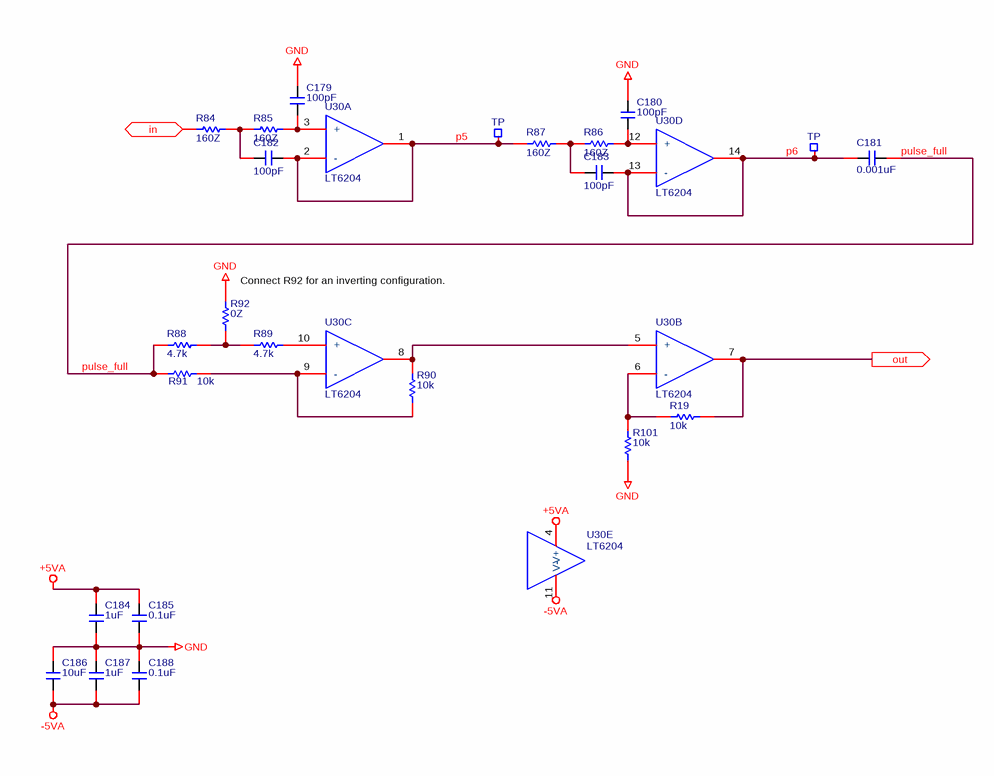
[diagram p11: integrator_inverter.SchDoc]

### Parts
C179  100pF  [C0603]
C180  100pF  [C0603]
C181  0.001uF  [C0603]
C182  100pF  [C0603]
C183  100pF  [C0603]
C184  1uF  [C0603]
C185  0.1uF  [C0603]
C186  10uF  [c1206]
C187  1uF  [C0603]
C188  0.1uF  [C0603]
R19  10k  [R0603]
R84  160Z  [R0603]
R85  160Z  [R0603]
R86  160Z  [R0603]
R87  160Z  [R0603]
R88  4.7k  [R0603]
R89  4.7k  [R0603]
R90  10k  [R0603]
R91  10k  [R0603]
R92  0Z  [R0603]
R101  10k  [R0603]
TP36  TP  [TP_MICRO]  (no BOM)
TP37  TP  [TP_MICRO]  (no BOM)
U30  LT6204  [SOIC-14]  (parts A,B,C,D,E of 5)

### Ports
in (in), out (out)

### Nets
+5VA: C184.2 C185.2 U30.4(V+)
-5VA: C186.1 C187.1 C188.1 U30.11(V-)
GND: C179.2 C180.2 C184.1 C185.1 C186.2 C187.2 C188.2 R92.1 R101.2
p4: R84.1 ; port in
p5: C182.2 R87.1 TP36.1 U30.1(OUT) U30.2(-)
p6: C181.2 C183.2 TP37.1 U30.13(-) U30.14(OUT)
pulse_full: C181.1 R88.1 R91.1
pulse_offset: R19.2 U30.7(OUT) ; port out
NetC179_1: C179.1 R85.2 U30.3(+)
NetC180_1: C180.1 R86.2 U30.12(+)
NetC182_1: C182.1 R84.2 R85.1
NetC183_1: C183.1 R86.1 R87.2
NetR19_1: R19.1 R101.1 U30.6(-)
NetR88_2: R88.2 R89.1 R92.2
NetR89_2: R89.2 U30.10(+)
NetR90_1: R90.1 U30.5(+) U30.8(OUT)
NetR90_2: R90.2 R91.2 U30.9(-)

### Notes on the sheet
- (near R92) Connect R92 for an inverting configuration.
- Date:
- Rev:
- of
- Sheet

### Library data of the parts
C179 C180 C182 C183 = AVX/06035A101KAT2A: as C168-C173 on sheet integrator_4pole; Supplier 1: Digi-Key; Supplier Part Number 1: 478-3717-1-ND; Manufacturer Part Number: 06035A101KAT2A; RoHS: RoHS Compliant; Category: Capacitors; Stock 1: 55355; Pricing 1: 1=0.16, 10=0.117, 25=0.0856, 50=0.0664, 100=0.0551, 250=0.04556, 500=0.03862, 1000=0.03197 (USD); Packaging: Cut Tape (CT); Part Status: Active; Capacitance: 100pF; Tolerance: ±10%; Voltage - Rated: 50V; Operating Temperature: -55°C ~ 125°C; Features: -; Ratings: -; Applications: General Purpose; Failure Rate: *; Mounting Type: Surface Mount, MLCC; Package / Case: 0603 (1608 Metric); Size / Dimension: 0.063" L x 0.032" W (1.60mm x 0.81mm); Height - Seated (Max): -; Thickness (Max): 0.035" (0.90mm); Lead Spacing: -; Lead Style: -; ComponentLink1URL: http://catalogs.avx.com/SurfaceMount.pdf; ComponentLink1Description: http://catalogs.avx.com/SurfaceMount.pdf
C181 = CAP/GRM188R71H102KA01D: CAP-CER, 0, 1000pF, 10%, 50V, 0603; Manufacturer: Murata Electronics North America; Temperature Coefficient: X7R; Supplier 1: Digi-Key; Supplier Part Number 1: 490-1494-6-ND; Manufacturer Part Number: GRM188R71H102KA01D; RoHS: RoHS Compliant; Category: Capacitors; Stock 1: 1044569; Pricing 1: 1=0.1, 10=0.02, 50=0.0108, 100=0.0091, 250=0.00744, 500=0.00636, 1000=0.00495 (USD); Packaging: Digi-Reel®; Capacitance: 1000pF; Tolerance: ±10%; Voltage - Rated: 50V; Mounting Type: Surface Mount, MLCC; Operating Temperature: -55°C ~ 125°C; Applications: General Purpose; Ratings: -; Package / Case: 0603 (1608 Metric); Size / Dimension: 0.063" L x 0.031" W (1.60mm x 0.80mm); Height - Seated (Max): -; Thickness (Max): 0.035" (0.90mm); Lead Spacing: -; Features: -; Lead Style: -; ComponentLink1URL: http://www.murata.com/~/media/webrenewal/support/library/catalog/products/capacitor/mlcc/c02e.pdf; ComponentLink1Description: http://www.murata.com/~/media/webrenewal/support/library/catalog/products/capacitor/mlcc/c02e.pdf; Supplier 2: Newark; Supplier Part Number 2: 51B220
C184 C187 = Murata/GRM188R61E105KA12D: as C79 on sheet integrator_4pole; Supplier 1: Digi-Key; Supplier Part Number 1: 490-3897-1-ND; Manufacturer Part Number: GRM188R61E105KA12D; RoHS: RoHS Compliant; Category: Capacitors; Stock 1: 1899119; Pricing 1: 1=0.1, 10=0.036, 50=0.0196, 100=0.0165, 250=0.01352, 500=0.01156, 1000=0.009 (USD); Packaging: Cut Tape (CT); Tolerance: ±10%; Voltage - Rated: 25V; Mounting Type: Surface Mount, MLCC; Operating Temperature: -55°C ~ 85°C; Applications: General Purpose; Ratings: -; Package / Case: 0603 (1608 Metric); Size / Dimension: 0.063" L x 0.031" W (1.60mm x 0.80mm); Height - Seated (Max): -; Thickness (Max): 0.035" (0.90mm); Lead Spacing: -; Features: -; Lead Style: -; ComponentLink1URL: http://www.murata.com/~/media/webrenewal/support/library/catalog/products/capacitor/mlcc/c02e.pdf; ComponentLink1Description: http://www.murata.com/~/media/webrenewal/support/library/catalog/products/capacitor/mlcc/c02e.pdf
C185 C188 = CAP/06035C104KAT2A: as C176 on sheet integrator_4pole; Supplier 1: Digi-Key; Manufacturer Part Number: 06035C104KAT2A; RoHS: RoHS Compliant; Category: Capacitors; Stock 1: 4412408; Pricing 1: 1=0.1, 10=0.036, 25=0.0264, 50=0.0198, 100=0.0162, 250=0.01352, 500=0.01156, 1000=0.00908 (USD); Packaging: Cut Tape (CT); Tolerance: ±10%; Voltage - Rated: 50V; Temperature Coefficient: X7R; Mounting Type: Surface Mount, MLCC; Operating Temperature: -55°C ~ 125°C; Applications: General Purpose; Ratings: -; Package / Case: 0603 (1608 Metric); Size / Dimension: 0.063" L x 0.032" W (1.60mm x 0.81mm); Height - Seated (Max): -; Thickness (Max): 0.035" (0.90mm); Lead Spacing: -; Features: -; Lead Style: -; ComponentLink1URL: http://datasheets.avx.com/X7RDielectric.pdf; ComponentLink1Description: http://datasheets.avx.com/X7RDielectric.pdf; Supplier Part Number 1: 478-5052-1-ND; Supplier 2: Newark; Supplier Part Number 2: 54K2412
C186 = CAP/GMK316F106ZL-T: as C78 on sheet integrator_4pole; Supplier 1: Digi-Key; Manufacturer Part Number: GMK316F106ZL-T; RoHS: RoHS Compliant; Category: Capacitors; Packaging: Cut Tape (CT); Voltage - Rated: 35V; Mounting Type: Surface Mount, MLCC; Operating Temperature: -30°C ~ 85°C; Package / Case: 1206 (3216 Metric); Size / Dimension: 0.126" L x 0.063" W (3.20mm x 1.60mm); Height - Seated (Max): -; Lead Spacing: -; Features: -; ComponentLink1URL: http://ds.yuden.co.jp/TYCOMPAS/ut/detail.do?productNo=GMK316F106ZL-T&fileName=GMK316F106ZL-T_SS&mode=specSheetDownload; ComponentLink1Description: http://ds.yuden.co.jp/TYCOMPAS/ut/detail.do?productNo=GMK316F106ZL-T&fileName=GMK316F106ZL-T_SS&mode=specSheetDownload; Supplier Part Number 1: 587-1352-1-ND; Stock 1: 249989; Pricing 1: 1=0.46, 10=0.345, 50=0.2012, 100=0.161, 250=0.115, 500=0.0782, 1000=0.06325 (USD); Applications: General Purpose; Ratings: -; Thickness (Max): 0.071" (1.80mm); Lead Style: -
R19 R90 R91 R101 = CRCW060310K0FKEA: RES1, SMD, 10.0k, 1.0%, 1/10W, 0603; Manufacturer: Vishay Dale; Tolerance: ±1%; Power (Watts): 0.1W, 1/10W; Temperature Coefficient: ±100ppm/°C; Supplier 1: Digi-Key; Manufacturer Part Number: CRCW060310K0FKEA; RoHS: RoHS Compliant; Category: Resistors; Stock 1: 1592879; Pricing 1: 1=0.1, 10=0.03, 25=0.022, 50=0.0168, 100=0.0123, 250=0.0094, 500=0.00752, 1000=0.00554, 2500=0.00481 (USD); Packaging: Cut Tape (CT); Resistance (Ohms): 10k; Composition: Thick Film; Features: Automotive AEC-Q200; Operating Temperature: -55°C ~ 155°C; Package / Case: 0603 (1608 Metric); Supplier Device Package: 0603; Size / Dimension: 0.061" L x 0.033" W (1.55mm x 0.85mm); Height: 0.020" (0.50mm); Number of Terminations: 2; ComponentLink1URL: http://www.vishay.com/docs/20035/dcrcwe3.pdf; ComponentLink1Description: http://www.vishay.com/docs/20035/dcrcwe3.pdf; Supplier Part Number 1: 541-10.0KHCT-ND
R84-R87 = CRCW0603160RFKEA: as R76-R83 on sheet integrator_4pole; Supplier 1: Digi-Key; Manufacturer Part Number: CRCW0603160RFKEA; RoHS: RoHS Compliant; Category: Resistors; Stock 1: 48671; Pricing 1: 1=0.1, 10=0.03, 25=0.022, 50=0.0168, 100=0.0123, 250=0.0094, 500=0.00752, 1000=0.00554, 2500=0.00481 (USD); Packaging: Cut Tape (CT); Part Status: Active; Composition: Thick Film; Features: Automotive AEC-Q200; Operating Temperature: -55°C ~ 155°C; Package / Case: 0603 (1608 Metric); Supplier Device Package: 0603; Size / Dimension: 0.063" L x 0.033" W (1.60mm x 0.85mm); Height - Seated (Max): 0.020" (0.50mm); Number of Terminations: 2; Failure Rate: -; ComponentLink1URL: http://www.vishay.com/docs/20035/dcrcwe3.pdf; ComponentLink1Description: http://www.vishay.com/docs/20035/dcrcwe3.pdf; Supplier Part Number 1: 541-160HCT-ND
R88 R89 = CRCW06034K70FKEA: RES1, SMD, 4.70k, 1.0%, 1/10W, 0603; Manufacturer: Vishay Dale; Tolerance: ±1%; Power (Watts): 0.1W, 1/10W; Temperature Coefficient: ±100ppm/°C; Supplier 1: Digi-Key; Supplier Part Number 1: 541-4.70KHCT-ND; Manufacturer Part Number: CRCW06034K70FKEA; RoHS: RoHS Compliant; Category: Resistors; Packaging: Cut Tape (CT); Part Status: Active; Resistance (Ohms): 4.7k; Composition: Thick Film; Features: Automotive AEC-Q200; Operating Temperature: -55°C ~ 155°C; Package / Case: 0603 (1608 Metric); Supplier Device Package: 0603; Size / Dimension: 0.063" L x 0.033" W (1.60mm x 0.85mm); Height - Seated (Max): 0.020" (0.50mm); Number of Terminations: 2; Failure Rate: -; ComponentLink1URL: http://www.vishay.com/docs/20035/dcrcwe3.pdf; ComponentLink1Description: http://www.vishay.com/docs/20035/dcrcwe3.pdf; Stock 1: 413202; Pricing 1: 1=0.1, 10=0.03, 25=0.022, 50=0.0168, 100=0.0123, 250=0.0094, 500=0.00752, 1000=0.00554, 2500=0.00481 (USD)
R92 = CRCW06030000Z0EA: RES0, SMD, 0.00Z, 0603; Manufacturer: Vishay Dale; Resistance (Ohms): 0.0; Tolerance: Jumper; Power (Watts): 0.1W, 1/10W; Supplier 1: Digi-Key; Manufacturer Part Number: CRCW06030000Z0EA; RoHS: RoHS Compliant; Category: Resistors; Stock 1: 3403646; Pricing 1: 1=0.1, 10=0.022, 25=0.016, 50=0.0124, 100=0.0091, 250=0.00692, 500=0.00554, 1000=0.00408, 2500=0.00354 (USD); Packaging: Cut Tape (CT); Composition: Thick Film; Features: Automotive AEC-Q200; Temperature Coefficient: -; Operating Temperature: -55°C ~ 155°C; Package / Case: 0603 (1608 Metric); Supplier Device Package: 0603; Size / Dimension: 0.061" L x 0.033" W (1.55mm x 0.85mm); Height: 0.020" (0.50mm); Number of Terminations: 2; ComponentLink1URL: http://www.vishay.com/docs/20035/dcrcwe3.pdf; ComponentLink1Description: http://www.vishay.com/docs/20035/dcrcwe3.pdf; Supplier Part Number 1: 541-0.0GCT-ND; Supplier 2: Newark; Supplier Part Number 2: 52K8014
TP36 TP37 = TP_MICRO: Test Point, Round, Small
U30 = LT6204 SOIC-14: OPA, 100MHz, Quad, RRIO, Unity Stable; Supplier 1: Digi-Key; Supplier Part Number 1: LT6204CS#PBF-ND

## Sheet clk40.SchDoc: FPGA Clock
size A; Engineer: A. Peck; Organization: UCLA High Energy Physics; DocumentNumber: 9; Revision: 3.0; SheetNumber: 9; SheetTotal: 15; Project: LCT Comparator Tester
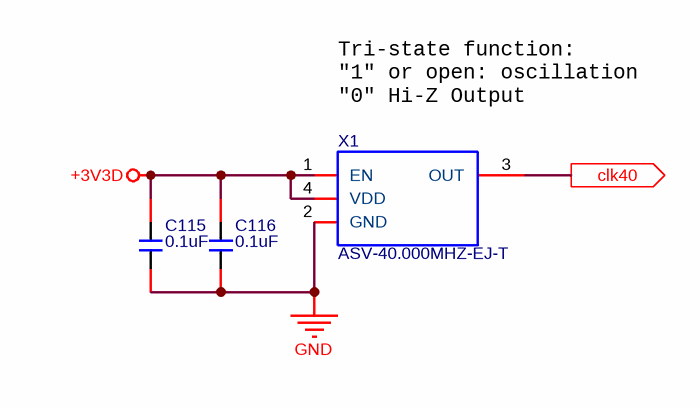
[diagram p12: clk40.SchDoc]

### Parts
C115  0.1uF  [C0603]
C116  0.1uF  [C0603]
X1  ASV-40.000MHZ-EJ-T  [XTAL-SMD]

### Ports
clk40 (out)

### Nets
+3V3D: C115.1 C116.1 X1.1(EN) X1.4(VDD)
GND: C115.2 C116.2 X1.2(GND)
NetR102_2: X1.3(OUT) ; port clk40

### Notes on the sheet
- (near X1) Tri-state function:
  "1" or open: oscillation
  "0" Hi-Z Output
- Date:
- Rev:
- of
- Sheet

### Library data of the parts
C115 C116 = CAP/06035C104KAT2A: as C176 on sheet integrator_4pole; Supplier 1: Digi-Key; Manufacturer Part Number: 06035C104KAT2A; RoHS: RoHS Compliant; Category: Capacitors; Stock 1: 4412408; Pricing 1: 1=0.1, 10=0.036, 25=0.0264, 50=0.0198, 100=0.0162, 250=0.01352, 500=0.01156, 1000=0.00908 (USD); Packaging: Cut Tape (CT); Tolerance: ±10%; Voltage - Rated: 50V; Temperature Coefficient: X7R; Mounting Type: Surface Mount, MLCC; Operating Temperature: -55°C ~ 125°C; Applications: General Purpose; Ratings: -; Package / Case: 0603 (1608 Metric); Size / Dimension: 0.063" L x 0.032" W (1.60mm x 0.81mm); Height - Seated (Max): -; Thickness (Max): 0.035" (0.90mm); Lead Spacing: -; Features: -; Lead Style: -; ComponentLink1URL: http://datasheets.avx.com/X7RDielectric.pdf; ComponentLink1Description: http://datasheets.avx.com/X7RDielectric.pdf; Supplier Part Number 1: 478-5052-1-ND; Supplier 2: Newark; Supplier Part Number 2: 54K2412
X1 = ASV-40.000MHZ-EJ-T: XTAL, 40MHz, CMOS; Manufacturer: Abracon LLC; Function: Enable/Disable; Output: HCMOS; Voltage - Supply: 3.3V; Frequency Stability: ±20ppm; Current - Supply (Max): 25mA; Current - Supply (Disable) (Max): 10µA; Supplier 1: Digi-Key; Manufacturer Part Number: ASV-40.000MHZ-EJ-T; RoHS: RoHS Compliant; Category: Crystals and Oscillators; Stock 1: 8558; Pricing 1: 1=1.34, 10=1.186, 50=1.1074, 100=0.98, 500=0.9261 (USD); Packaging: Cut Tape (CT); Part Status: Active; Type: XO (Standard); Frequency: 40MHz; Operating Temperature: -20°C ~ 70°C; Ratings: -; Mounting Type: Surface Mount; Size / Dimension: 0.276" L x 0.200" W (7.00mm x 5.08mm); Height: 0.071" (1.80mm); Package / Case: 4-SMD, No Lead (DFN, LCC); ComponentLink1URL: http://www.abracon.com/Oscillators/ASV.pdf; ComponentLink1Description: http://www.abracon.com/Oscillators/ASV.pdf; Supplier Part Number 1: 535-9327-1-ND

## Sheet pulse_mux.SchDoc: Analog Pulse Multiplexer
size A; Engineer: A. Peck; Organization: UCLA High Energy Physics; DocumentNumber: 10; Revision: 3.0; SheetNumber: 10; SheetTotal: 15; Project: LCT Comparator Tester
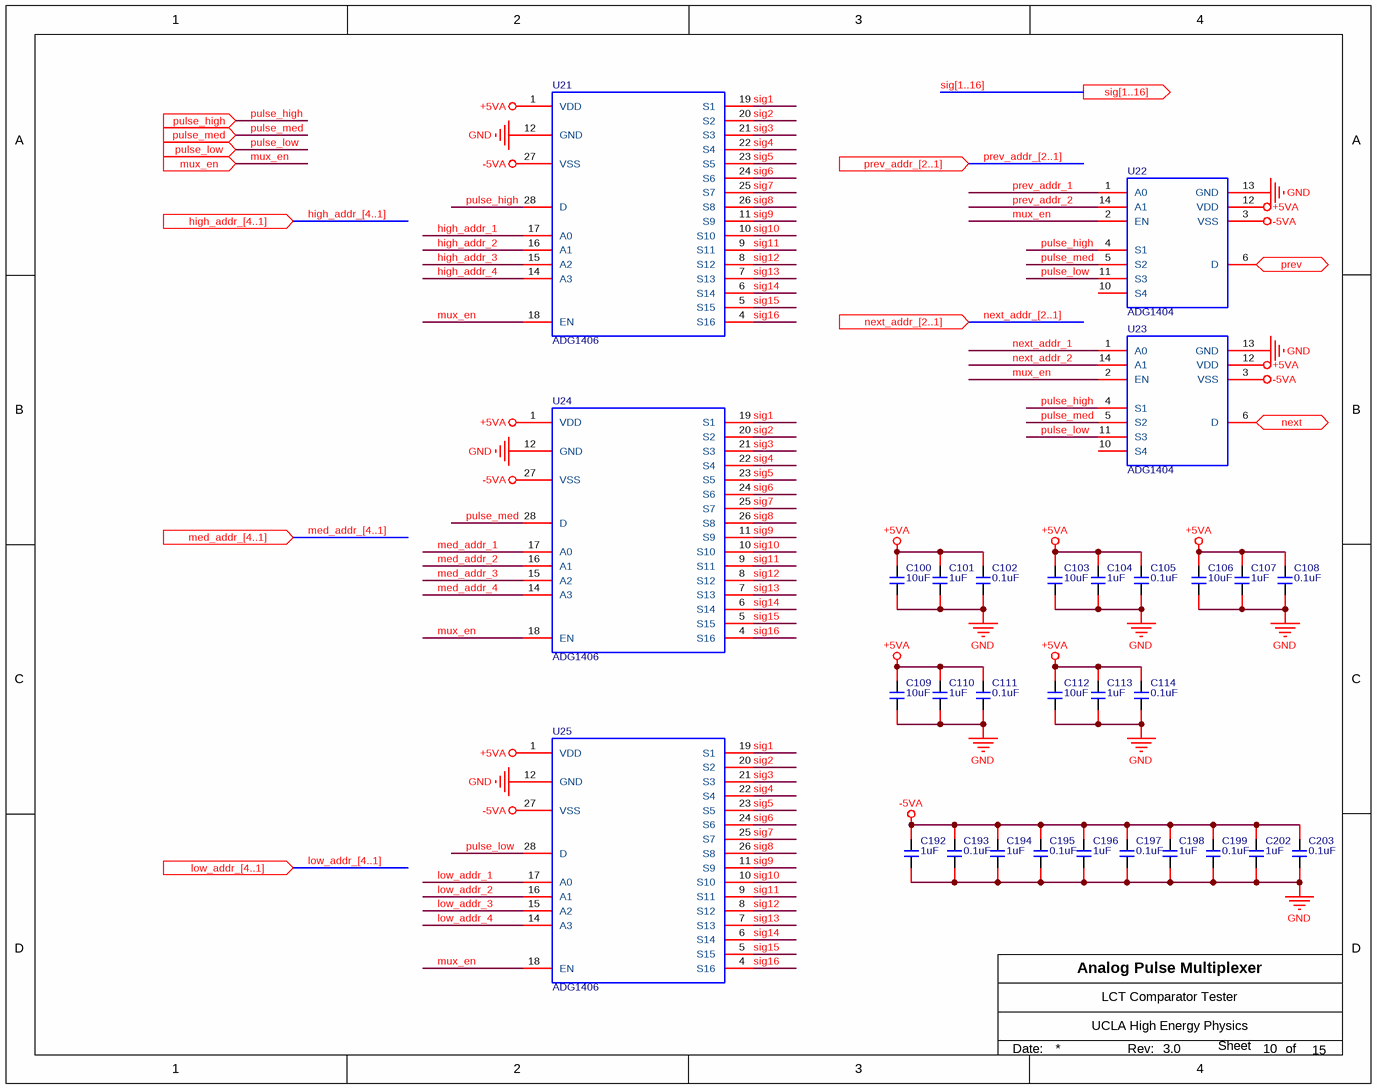
[diagram p13: pulse_mux.SchDoc]

### Parts
C100  10uF  [c1206]
C101  1uF  [C0603]
C102  0.1uF  [C0603]
C103  10uF  [c1206]
C104  1uF  [C0603]
C105  0.1uF  [C0603]
C106  10uF  [c1206]
C107  1uF  [C0603]
C108  0.1uF  [C0603]
C109  10uF  [c1206]
C110  1uF  [C0603]
C111  0.1uF  [C0603]
C112  10uF  [c1206]
C113  1uF  [C0603]
C114  0.1uF  [C0603]
C192  1uF  [C0603]
C193  0.1uF  [C0603]
C194  1uF  [C0603]
C195  0.1uF  [C0603]
C196  1uF  [C0603]
C197  0.1uF  [C0603]
C198  1uF  [C0603]
C199  0.1uF  [C0603]
C202  1uF  [C0603]
C203  0.1uF  [C0603]
U21  ADG1406  [SSOP-28]
U22  ADG1404  [TSSOP-14]
U23  ADG1404  [TSSOP-14]
U24  ADG1406  [SSOP-28]
U25  ADG1406  [SSOP-28]

### Ports
high_addr_[4..1] (in), low_addr_[4..1] (in), med_addr_[4..1] (in), mux_en (in), next (out), next_addr_[2..1] (in), prev (out), prev_addr_[2..1] (in), pulse_high (in), pulse_low (in), pulse_med (in), sig[1..16] (out)

### Nets
+5VA: C100.1 C101.2 C102.2 C103.1 C104.2 C105.2 C106.1 C107.2 C108.2 C109.1 C110.2 C111.2 C112.1 C113.2 C114.2 U21.1(VDD) U22.12(VDD) U23.12(VDD) U24.1(VDD) U25.1(VDD)
-5VA: C192.2 C193.2 C194.2 C195.2 C196.2 C197.2 C198.2 C199.2 C202.2 C203.2 U21.27(VSS) U22.3(VSS) U23.3(VSS) U24.27(VSS) U25.27(VSS)
GND: C100.2 C101.1 C102.1 C103.2 C104.1 C105.1 C106.2 C107.1 C108.1 C109.2 C110.1 C111.1 C112.2 C113.1 C114.1 C192.1 C193.1 C194.1 C195.1 C196.1 C197.1 C198.1 C199.1 C202.1 C203.1 U21.12(GND) U22.13(GND) U23.13(GND) U24.12(GND) U25.12(GND)
high_addr_1: U21.17(A0)
high_addr_2: U21.16(A1)
high_addr_3: U21.15(A2)
high_addr_4: U21.14(A3)
low_addr_1: U25.17(A0)
low_addr_2: U25.16(A1)
low_addr_3: U25.15(A2)
low_addr_4: U25.14(A3)
med_addr_1: U24.17(A0)
med_addr_2: U24.16(A1)
med_addr_3: U24.15(A2)
med_addr_4: U24.14(A3)
mux_en: U21.18(EN) U22.2(EN) U23.2(EN) U24.18(EN) U25.18(EN) ; port mux_en
next_addr_1: U23.1(A0)
next_addr_2: U23.14(A1)
prev_addr_1: U22.1(A0)
prev_addr_2: U22.14(A1)
pulse_high: U21.28(D) U22.4(S1) U23.4(S1) ; port pulse_high
pulse_low: U22.11(S3) U23.11(S3) U25.28(D) ; port pulse_low
pulse_med: U22.5(S2) U23.5(S2) U24.28(D) ; port pulse_med
sig1: U21.19(S1) U24.19(S1) U25.19(S1)
sig2: U21.20(S2) U24.20(S2) U25.20(S2)
sig3: U21.21(S3) U24.21(S3) U25.21(S3)
sig4: U21.22(S4) U24.22(S4) U25.22(S4)
sig5: U21.23(S5) U24.23(S5) U25.23(S5)
sig6: U21.24(S6) U24.24(S6) U25.24(S6)
sig7: U21.25(S7) U24.25(S7) U25.25(S7)
sig8: U21.26(S8) U24.26(S8) U25.26(S8)
sig9: U21.11(S9) U24.11(S9) U25.11(S9)
sig10: U21.10(S10) U24.10(S10) U25.10(S10)
sig11: U21.9(S11) U24.9(S11) U25.9(S11)
sig12: U21.8(S12) U24.8(S12) U25.8(S12)
sig13: U21.7(S13) U24.7(S13) U25.7(S13)
sig14: U21.6(S14) U24.6(S14) U25.6(S14)
sig15: U21.5(S15) U24.5(S15) U25.5(S15)
sig16: U21.4(S16) U24.4(S16) U25.4(S16)
NetC24_1: U22.6(D) ; port prev
NetC48_1: U23.6(D) ; port next

Not connected (* = marked no-connect by the designer): U21 2(NC) 3(NC) 13(NC); U22 7(NC) 8(NC) 9(NC) 10(S4); U23 7(NC) 8(NC) 9(NC) 10(S4); U24 2(NC) 3(NC) 13(NC); U25 2(NC) 3(NC) 13(NC)

### Buses and harness runs
bus high_addr_[4..1] = port high_addr_[4..1]
bus low_addr_[4..1] = port low_addr_[4..1]
bus med_addr_[4..1] = port med_addr_[4..1]
bus next_addr_[2..1] = port next_addr_[2..1]
bus prev_addr_[2..1] = port prev_addr_[2..1]
bus sig[1..16] = port sig[1..16]

### Notes on the sheet
- Date:
- Rev:
- of
- Sheet

### Library data of the parts
C100 C103 C106 C109 C112 = CAP/GMK316F106ZL-T: as C78 on sheet integrator_4pole; Supplier 1: Digi-Key; Manufacturer Part Number: GMK316F106ZL-T; RoHS: RoHS Compliant; Category: Capacitors; Packaging: Cut Tape (CT); Voltage - Rated: 35V; Operating Temperature: -30°C ~ 85°C; Mounting Type: Surface Mount, MLCC; Package / Case: 1206 (3216 Metric); Size / Dimension: 0.126" L x 0.063" W (3.20mm x 1.60mm); Height - Seated (Max): -; Lead Spacing: -; Features: -; ComponentLink1URL: http://ds.yuden.co.jp/TYCOMPAS/ut/detail.do?productNo=GMK316F106ZL-T&fileName=GMK316F106ZL-T_SS&mode=specSheetDownload; ComponentLink1Description: http://ds.yuden.co.jp/TYCOMPAS/ut/detail.do?productNo=GMK316F106ZL-T&fileName=GMK316F106ZL-T_SS&mode=specSheetDownload; Supplier Part Number 1: 587-1352-1-ND; Stock 1: 249989; Pricing 1: 1=0.46, 10=0.345, 50=0.2012, 100=0.161, 250=0.115, 500=0.0782, 1000=0.06325 (USD); Applications: General Purpose; Ratings: -; Thickness (Max): 0.071" (1.80mm); Lead Style: -
C101 C104 C107 C110 C113 C192 C194 C196 C198 C202 = Murata/GRM188R61E105KA12D: as C79 on sheet integrator_4pole; Supplier 1: Digi-Key; Supplier Part Number 1: 490-3897-1-ND; Manufacturer Part Number: GRM188R61E105KA12D; RoHS: RoHS Compliant; Category: Capacitors; Stock 1: 1899119; Pricing 1: 1=0.1, 10=0.036, 50=0.0196, 100=0.0165, 250=0.01352, 500=0.01156, 1000=0.009 (USD); Packaging: Cut Tape (CT); Tolerance: ±10%; Voltage - Rated: 25V; Mounting Type: Surface Mount, MLCC; Operating Temperature: -55°C ~ 85°C; Applications: General Purpose; Ratings: -; Package / Case: 0603 (1608 Metric); Size / Dimension: 0.063" L x 0.031" W (1.60mm x 0.80mm); Height - Seated (Max): -; Thickness (Max): 0.035" (0.90mm); Lead Spacing: -; Features: -; Lead Style: -; ComponentLink1URL: http://www.murata.com/~/media/webrenewal/support/library/catalog/products/capacitor/mlcc/c02e.pdf; ComponentLink1Description: http://www.murata.com/~/media/webrenewal/support/library/catalog/products/capacitor/mlcc/c02e.pdf
C102 C105 C108 C111 C114 C193 C195 C197 C199 C203 = CAP/06035C104KAT2A: as C176 on sheet integrator_4pole; Supplier 1: Digi-Key; Manufacturer Part Number: 06035C104KAT2A; RoHS: RoHS Compliant; Category: Capacitors; Stock 1: 4412408; Pricing 1: 1=0.1, 10=0.036, 25=0.0264, 50=0.0198, 100=0.0162, 250=0.01352, 500=0.01156, 1000=0.00908 (USD); Packaging: Cut Tape (CT); Tolerance: ±10%; Voltage - Rated: 50V; Temperature Coefficient: X7R; Mounting Type: Surface Mount, MLCC; Operating Temperature: -55°C ~ 125°C; Applications: General Purpose; Ratings: -; Package / Case: 0603 (1608 Metric); Size / Dimension: 0.063" L x 0.032" W (1.60mm x 0.81mm); Height - Seated (Max): -; Thickness (Max): 0.035" (0.90mm); Lead Spacing: -; Features: -; Lead Style: -; ComponentLink1URL: http://datasheets.avx.com/X7RDielectric.pdf; ComponentLink1Description: http://datasheets.avx.com/X7RDielectric.pdf; Supplier Part Number 1: 478-5052-1-ND; Supplier 2: Newark; Supplier Part Number 2: 54K2412
U21 U24 U25 = ADG1406/SSOP-28: MUX, 16:1, Single Supply; Manufacturer: Analog Devices Inc.; Manufacturer Part Number: ADG1406BRUZ; Number of Circuits: 1; On-State Resistance (Max): 11.5 Ohm; Channel-to-Channel Matching (&Delta;Ron): 550 mOhm; Voltage - Supply, Single (V+): 5 V ~ 16.5 V; Voltage - Supply, Dual (V±): ±4.5 V ~ 16.5 V; Switch Time (Ton, Toff) (Max): 110ns, 120ns; -3db Bandwidth: 60MHz; Charge Injection: 10pC; Channel Capacitance (CS(off), CD(off)): 8pF, 90pf; Current - Leakage (IS(off)) (Max): 250pA; Crosstalk: -70dB @ 1MHz; Supplier 1: Digi-Key; RoHS: RoHS Compliant; Category: Integrated Circuits (ICs); Stock 1: 698; Pricing 1: 1=10.46, 50=9.2172, 100=8.1211, 500=7.22426, 1000=6.62639, 2500=6.37728, 5000=6.17799 (USD); Packaging: Tube; Part Status: Active; Switch Circuit: -; Multiplexer/Demultiplexer Circuit: 16:1; Operating Temperature: -40°C ~ 125°C (TA); Package / Case: 28-TSSOP (0.173", 4.40mm Width); Supplier Device Package: 28-TSSOP; ComponentLink1URL: http://www.analog.com/media/en/technical-documentation/data-sheets/ADG1406_1407.pdf; ComponentLink1Description: http://www.analog.com/media/en/technical-documentation/data-sheets/ADG1406_1407.pdf; Supplier Part Number 1: ADG1406BRUZ-ND
U22 U23 = ADG1404 14-TSSOP: MUX, 4:1, Single; Manufacturer: Analog Devices Inc.; Manufacturer Part Number: ADG1404YRUZ; Switch Circuit: SP4T; Number of Circuits: 1; On-State Resistance (Max): 1.8 Ohm; Channel-to-Channel Matching (&Delta;Ron): 100 mOhm; Voltage - Supply, Single (V+): 5 V ~ 16.5 V; Voltage - Supply, Dual (V±): ±4.5 V ~ 16.5 V; Switch Time (Ton, Toff) (Max): 120ns, 135ns; -3db Bandwidth: 55MHz; Charge Injection: -20pC; Channel Capacitance (CS(off), CD(off)): 23pF, 90pF; Current - Leakage (IS(off)) (Max): 550pA; Crosstalk: -82dB @ 100kHz; Supplier 1: Digi-Key; RoHS: RoHS Compliant; Category: Integrated Circuits (ICs); Stock 1: 6039; Pricing 1: 1=6.98, 96=6.01625, 192=5.22385, 576=4.54885, 1056=3.96191, 2592=3.81517, 5000=3.66844 (USD); Packaging: Tube; Part Status: Active; Multiplexer/Demultiplexer Circuit: 4:1; Operating Temperature: -40°C ~ 125°C (TA); Package / Case: 14-TSSOP (0.173", 4.40mm Width); Supplier Device Package: 14-TSSOP; ComponentLink1URL: http://www.analog.com/media/en/technical-documentation/data-sheets/ADG1404.pdf; ComponentLink1Description: http://www.analog.com/media/en/technical-documentation/data-sheets/ADG1404.pdf; Supplier Part Number 1: ADG1404YRUZ-ND